# Altium schematic sheet Core.SchDoc: Core
size A4
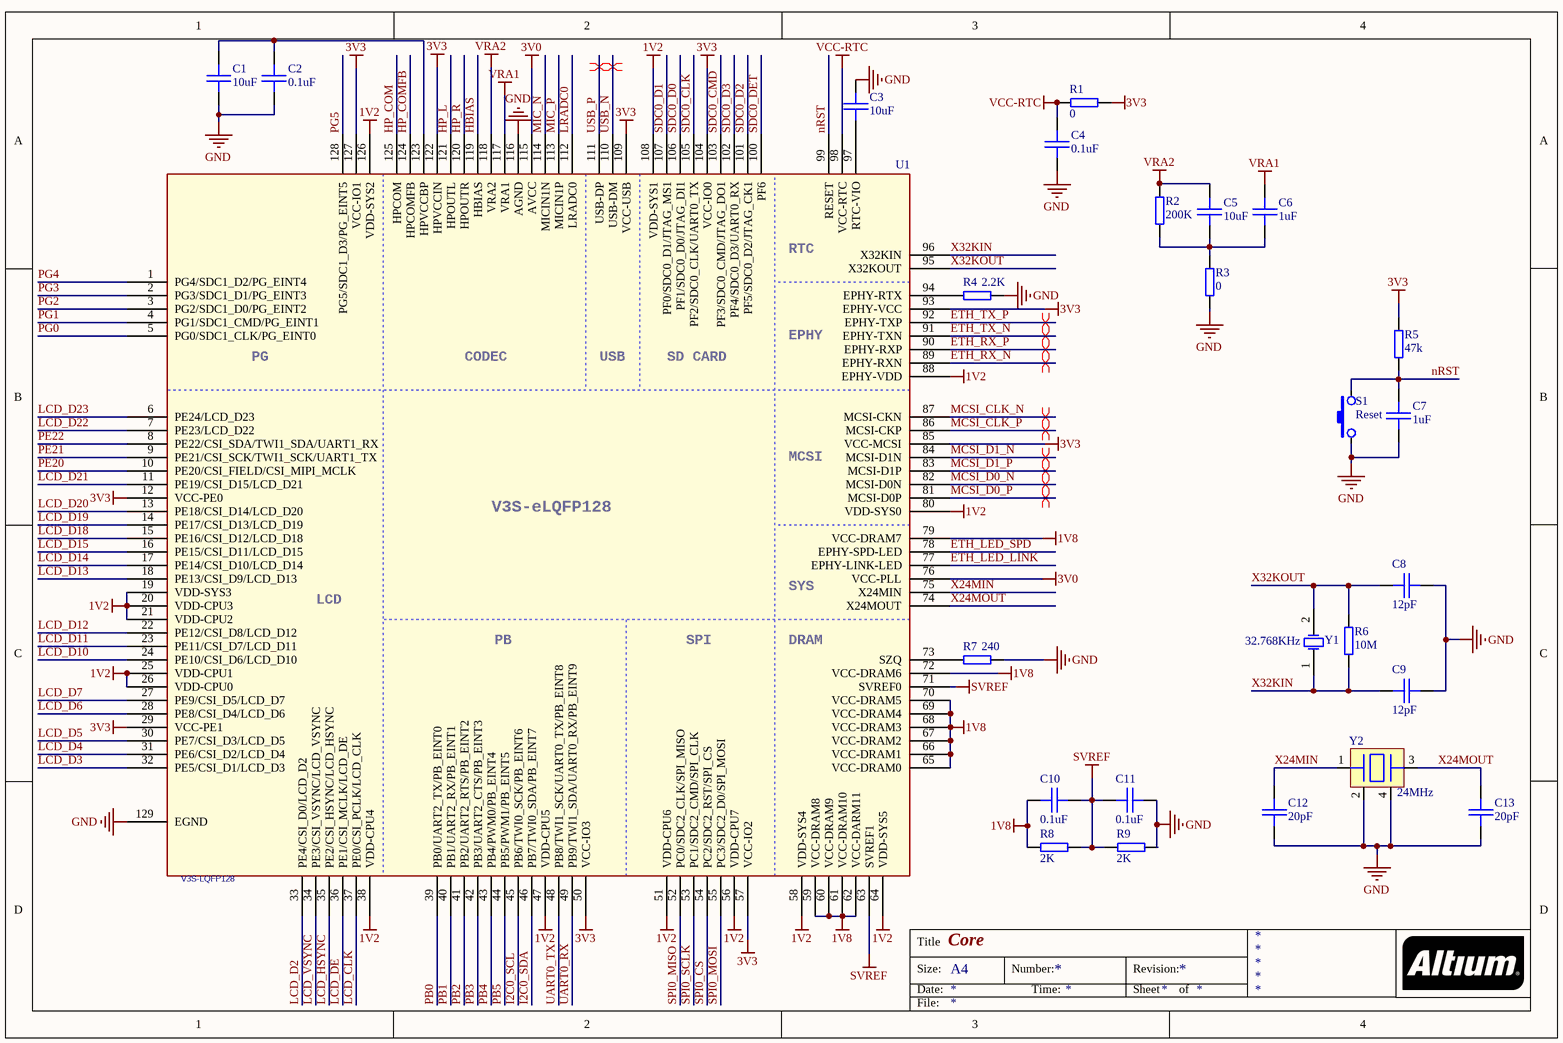
[diagram p0: Core.SchDoc]

## Parts
C1  10uF  [CAP-0603]
C2  0.1uF  [CAP-0603]
C3  10uF  [CAP-0603]
C4  0.1uF  [CAP-0603]
C5  10uF  [CAP-0603]
C6  1uF  [CAP-0603]
C7  1uF  [CAP-0603]
C8  12pF  [CAP-0603]
C9  12pF  [CAP-0603]
C10  0.1uF  [CAP-0603]
C11  0.1uF  [CAP-0603]
C12  20pF  [CAP-0603]
C13  20pF  [CAP-0603]
R1  0  [RES-0603]
R2  200K  [RES-0603]
R3  0  [RES-0603]
R4  2.2K  [RES-0603]
R5  47k  [RES-0603]
R6  10M  [RES-0603]
R7  240  [RES-0603]
R8  2K  [RES-0603]
R9  2K  [RES-0603]
S1  Reset  [KEY_3X4X2]
U1  V3S-LQFP128  [QFP-128]
Y1  32.768KHz  [FC-135(3215)]
Y2  24MHz  [LC-SMD-3225_4P]

## Nets
1V2: U1.19(VDD-SYS3) U1.20(VDD-CPU3) U1.21(VDD-CPU2) U1.25(VDD-CPU1) U1.26(VDD-CPU0) U1.38(VDD-CPU4) U1.47(VDD-CPU5) U1.51(VDD-CPU6) U1.56(VDD-CPU7) U1.58(VDD-SYS4) U1.64(VDD-SYS5) U1.80(VDD-SYS0) U1.88(EPHY-VDD) U1.108(VDD-SYS1) U1.126(VDD-SYS2)
1V8: C10.1 R8.1 U1.59(VCC-DRAM8) U1.60(VCC-DRAM9) U1.61(VCC-DRAM10) U1.62(VCC-DARM11) U1.65(VCC-DRAM0) U1.66(VCC-DRAM1) U1.67(VCC-DRAM2) U1.68(VCC-DRAM3) U1.69(VCC-DRAM4) U1.70(VCC-DRAM5) U1.72(VCC-DRAM6) U1.79(VCC-DRAM7)
3V0: U1.76(VCC-PLL) U1.115(AVCC)
3V3: R1.2 R5.2 U1.12(VCC-PE0) U1.29(VCC-PE1) U1.50(VCC-IO3) U1.57(VCC-IO2) U1.85(VCC-MCSI) U1.93(EPHY-VCC) U1.104(VCC-IO0) U1.109(VCC-USB) U1.122(HPVCCIN) U1.127(VCC-IO1)
GND: C1.2 C2.2 C3.1 C4.2 C7.2 C8.2 C9.2 C11.2 C12.2 C13.2 R3.1 R4.2 R7.2 R9.2 S1.1 U1.116(AGND) U1.129(EGND) Y2.2 Y2.4
SVREF: C10.2 C11.1 R8.2 R9.1 U1.63(SVREF1) U1.71(SVREF0)
VCC-RTC: C4.1 R1.1 U1.98(VCC-RTC)
VRA1: C6.1 U1.117(VRA1)
VRA2: C5.1 R2.2 U1.118(VRA2)
ETH_LED_LINK: U1.77(EPHY-LINK-LED)
ETH_LED_SPD: U1.78(EPHY-SPD-LED)
ETH_RX_N: U1.89(EPHY-RXN)
ETH_RX_P: U1.90(EPHY-RXP)
ETH_TX_N: U1.91(EPHY-TXN)
ETH_TX_P: U1.92(EPHY-TXP)
HBIAS: U1.119(HBIAS)
HP_COM: U1.125(HPCOM)
HP_COMFB: U1.124(HPCOMFB)
HP_L: U1.121(HPOUTL)
HP_R: U1.120(HPOUTR)
I2C0_SCL: U1.45(PB6/TWI0_SCK/PB_EINT6)
I2C0_SDA: U1.46(PB7/TWI0_SDA/PB_EINT7)
LCD_CLK: U1.37(PE0/CSI_PCLK/LCD_CLK)
LCD_D2: U1.33(PE4/CSI_D0/LCD_D2)
LCD_D3: U1.32(PE5/CSI_D1/LCD_D3)
LCD_D4: U1.31(PE6/CSI_D2/LCD_D4)
LCD_D5: U1.30(PE7/CSI_D3/LCD_D5)
LCD_D6: U1.28(PE8/CSI_D4/LCD_D6)
LCD_D7: U1.27(PE9/CSI_D5/LCD_D7)
LCD_D10: U1.24(PE10/CSI_D6/LCD_D10)
LCD_D11: U1.23(PE11/CSI_D7/LCD_D11)
LCD_D12: U1.22(PE12/CSI_D8/LCD_D12)
LCD_D13: U1.18(PE13/CSI_D9/LCD_D13)
LCD_D14: U1.17(PE14/CSI_D10/LCD_D14)
LCD_D15: U1.16(PE15/CSI_D11/LCD_D15)
LCD_D18: U1.15(PE16/CSI_D12/LCD_D18)
LCD_D19: U1.14(PE17/CSI_D13/LCD_D19)
LCD_D20: U1.13(PE18/CSI_D14/LCD_D20)
LCD_D21: U1.11(PE19/CSI_D15/LCD_D21)
LCD_D22: U1.7(PE23/LCD_D22)
LCD_D23: U1.6(PE24/LCD_D23)
LCD_DE: U1.36(PE1/CSI_MCLK/LCD_DE)
LCD_HSYNC: U1.35(PE2/CSI_HSYNC/LCD_HSYNC)
LCD_VSYNC: U1.34(PE3/CSI_VSYNC/LCD_VSYNC)
LRADC0: U1.112(LRADC0)
MCSI_CLK_N: U1.87(MCSI-CKN)
MCSI_CLK_P: U1.86(MCSI-CKP)
MCSI_D0_N: U1.82(MCSI-D0N)
MCSI_D0_P: U1.81(MCSI-D0P)
MCSI_D1_N: U1.84(MCSI-D1N)
MCSI_D1_P: U1.83(MCSI-D1P)
MIC_N: U1.114(MICIN1N)
MIC_P: U1.113(MICIN1P)
nRST: C7.1 R5.1 S1.2 U1.99(RESET)
PB0: U1.39(PB0/UART2_TX/PB_EINT0)
PB1: U1.40(PB1/UART2_RX/PB_EINT1)
PB2: U1.41(PB2/UART2_RTS/PB_EINT2)
PB3: U1.42(PB3/UART2_CTS/PB_EINT3)
PB4: U1.43(PB4/PWM0/PB_EINT4)
PB5: U1.44(PB5/PWM1/PB_EINT5)
PE20: U1.10(PE20/CSI_FIELD/CSI_MIPI_MCLK)
PE21: U1.9(PE21/CSI_SCK/TWI1_SCK/UART1_TX)
PE22: U1.8(PE22/CSI_SDA/TWI1_SDA/UART1_RX)
PG0: U1.5(PG0/SDC1_CLK/PG_EINT0)
PG1: U1.4(PG1/SDC1_CMD/PG_EINT1)
PG2: U1.3(PG2/SDC1_D0/PG_EINT2)
PG3: U1.2(PG3/SDC1_D1/PG_EINT3)
PG4: U1.1(PG4/SDC1_D2/PG_EINT4)
PG5: U1.128(PG5/SDC1_D3/PG_EINT5)
SDC0_CLK: U1.105(PF2/SDC0_CLK/UART0_TX)
SDC0_CMD: U1.103(PF3/SDC0_CMD/JTAG_DO1)
SDC0_D0: U1.106(PF1/SDC0_D0/JTAG_DI1)
SDC0_D1: U1.107(PF0/SDC0_D1/JTAG_MS1)
SDC0_D2: U1.101(PF5/SDC0_D2/JTAG_CK1)
SDC0_D3: U1.102(PF4/SDC0_D3/UART0_RX)
SDC0_DET: U1.100(PF6)
SPI0_CS: U1.54(PC2/SDC2_RST/SPI_CS)
SPI0_MISO: U1.52(PC0/SDC2_CLK/SPI_MISO)
SPI0_MOSI: U1.55(PC3/SDC2_D0/SPI_MOSI)
SPI0_SCLK: U1.53(PC1/SDC2_CMD/SPI_CLK)
UART0_RX: U1.49(PB9/TWI1_SDA/UART0_RX/PB_EINT9)
UART0_TX: U1.48(PB8/TWI1_SCK/UART0_TX/PB_EINT8)
USB_N: U1.110(USB-DM)
USB_P: U1.111(USB-DP)
X24MIN: C12.1 U1.75(X24MIN) Y2.1
X24MOUT: C13.1 U1.74(X24MOUT) Y2.3
X32KIN: C9.1 R6.1 U1.96(X32KIN) Y1.1(OSC1)
X32KOUT: C8.1 R6.2 U1.95(X32KOUT) Y1.2(OSC2)
NetC1_1: C1.1 C2.1 U1.123(HPVCCBP)
NetC3_2: C3.2 U1.97(RTC-VIO)
NetC5_2: C5.2 C6.2 R2.1 R3.2
NetR4_1: R4.1 U1.94(EPHY-RTX)
NetR7_1: R7.1 U1.73(SZQ)

## Layout directives
differential pair: ETH_RX_N, ETH_RX_P, ETH_TX_N, ETH_TX_P, MCSI_CLK_N, MCSI_CLK_P, MCSI_D0_N, MCSI_D0_P, MCSI_D1_N, MCSI_D1_P, USB_N, USB_P

## Notes on the sheet
- Title
- Size:
- Date:
- A4
- Number:
- Time:
- Revision:
- Sheet
- of
- File:
- (in symbol V3S-LQFP128) RTC; EPHY; PG; CODEC; USB; SD CARD; MCSI; V3S-eLQFP128; SYS; LCD; PB; SPI; DRAM

## Library data of the parts
C1-C13 = C_0603: 陶瓷贴片电容0603; tolerance: 10%; voltage: 50V; ESR: 1.73mOhm; IRMS: 5.59A; Series: X7R
  C1 C3 C5: C_value: 10uF
  C2 C4 C10 C11: C_value: 0.1uF
  C6 C7: C_value: 1uF
  C8 C9: C_value: 12pF
  C12 C13: C_value: 20pF
R1-R9 = R_0603: 贴片电阻0603; tolerance: 5%; voltage: 50V; power: 0.063W
  R1 R3: R_value: 0
  R2: R_value: 200K
  R4: R_value: 2.2K
  R5: R_value: 47k
  R6: R_value: 10M
  R7: R_value: 240
  R8 R9: R_value: 2K
S1 = KEY: 轻触开关3X4X2
U1 = V3S-LQFP128: Allwinner V3S SoC
Y1 = OSC_32768: 32.768KHz时钟晶振; X_value: 32.768KHz
Y2 = XTAL_PASSIVE: 贴片无源晶振(3225); X_value: 24MHz